# EAGLE design B611B (EAGLE 6.6.0)
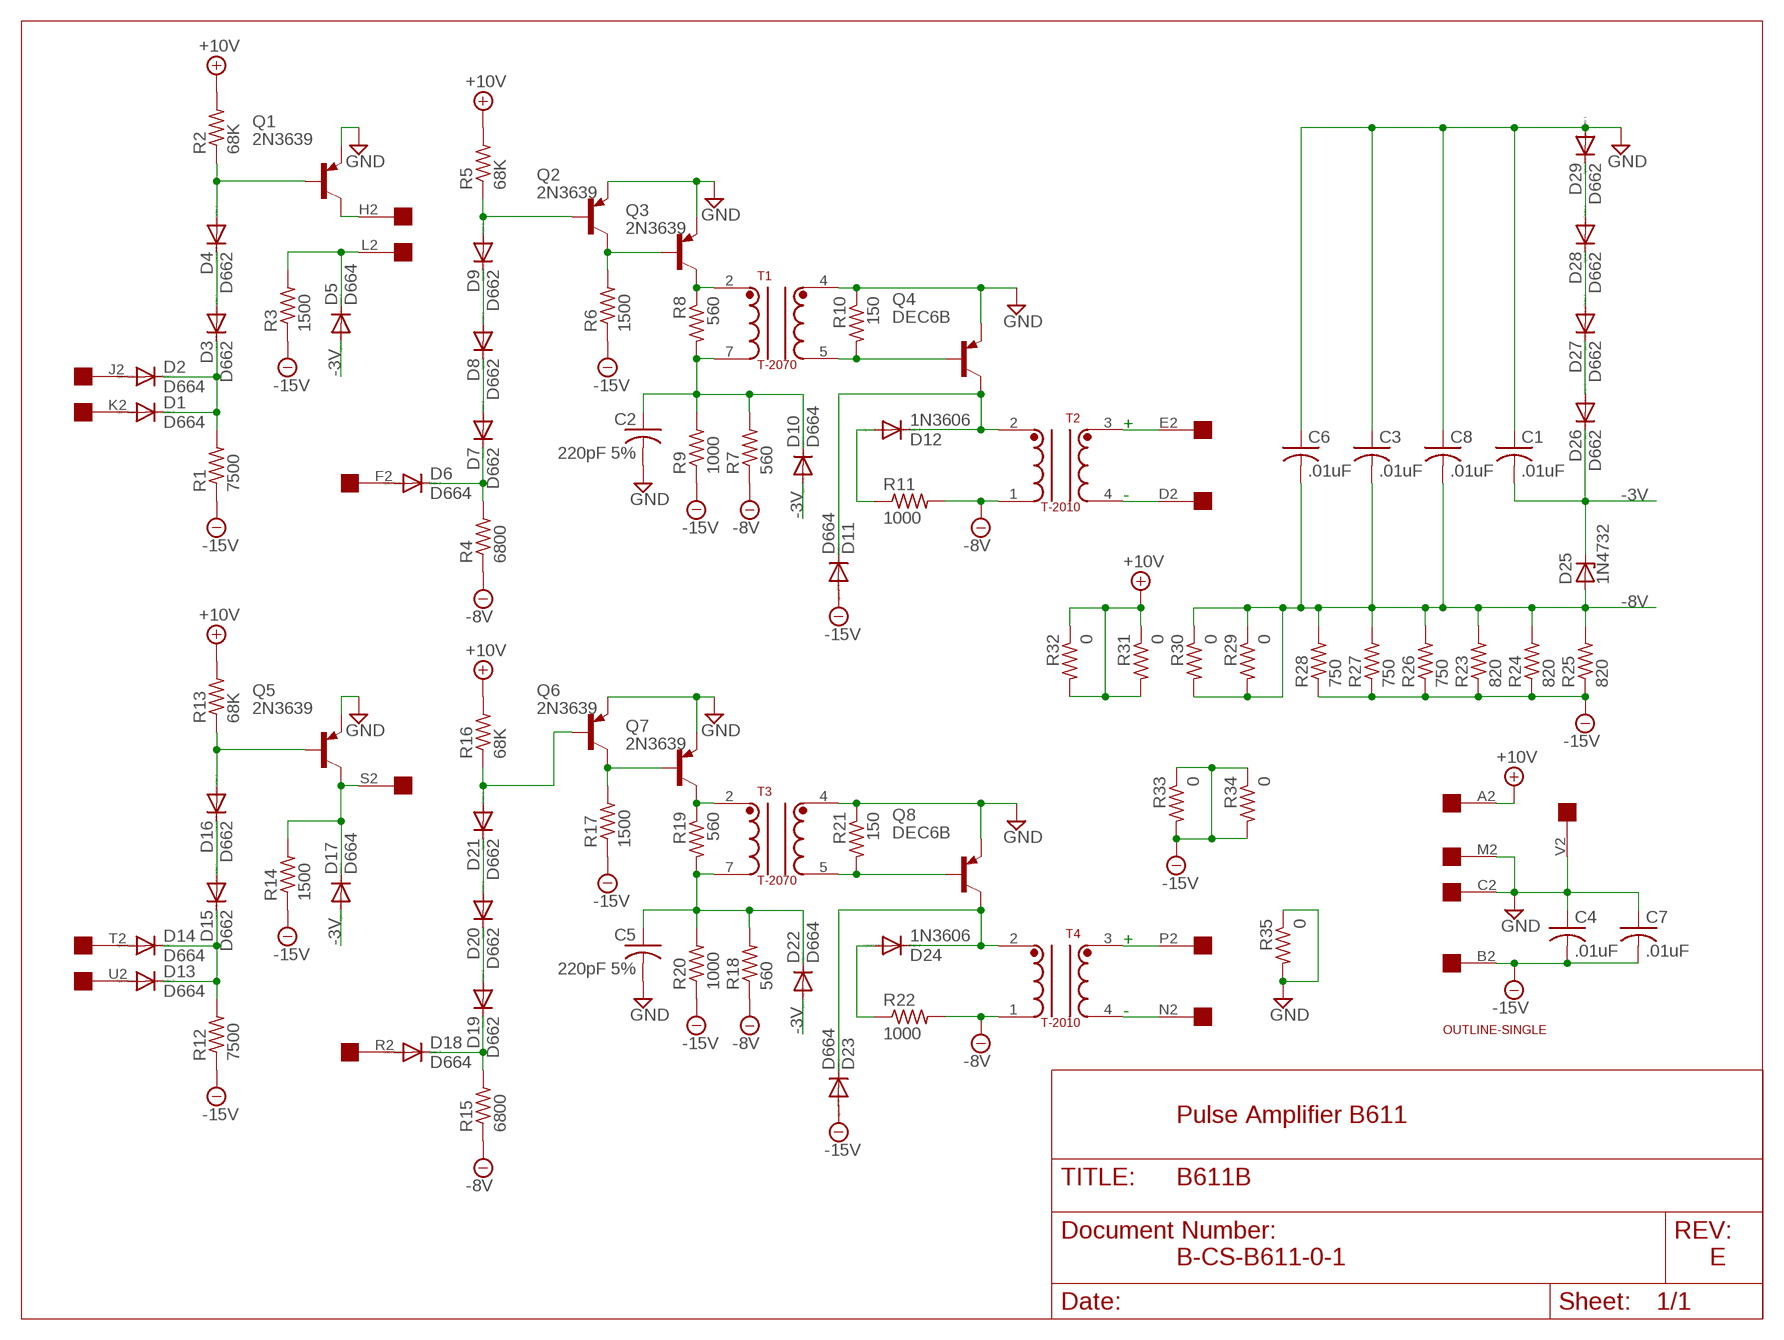
[diagram p0: schematic, sheet 1]

## Parts
C1  .01uF  C-US  [C063-025X075]
C2  220pF 5%  C-US150-054X183  [C150-054X183]
C3  .01uF  C-US  [C063-025X075]
C4  .01uF  C-US  [C063-025X075]
C5  220pF 5%  C-US150-054X183  [C150-054X183]
C6  .01uF  C-US  [C063-025X075]
C7  .01uF  C-US  [C063-025X075]
C8  .01uF  C-US  [C063-025X075]
D1  D664  1N4148DO35-10  [DO35-10]
D2  D664  1N4148DO35-10  [DO35-10]
D3  D662  1N4148DO35-10  [DO35-10]
D4  D662  1N4148DO35-10  [DO35-10]
D5  D664  1N4148DO35-10  [DO35-10]
D6  D664  1N4148DO35-10  [DO35-10]
D7  D662  1N4148DO35-10  [DO35-10]
D8  D662  1N4148DO35-10  [DO35-10]
D9  D662  1N4148DO35-10  [DO35-10]
D10  D664  1N4148DO35-10  [DO35-10]
D11  D664  1N4148DO35-10  [DO35-10]
D12  1N3606  1N4148DO35-10  [DO35-10]
D13  D664  1N4148DO35-10  [DO35-10]
D14  D664  1N4148DO35-10  [DO35-10]
D15  D662  1N4148DO35-10  [DO35-10]
D16  D662  1N4148DO35-10  [DO35-10]
D17  D664  1N4148DO35-10  [DO35-10]
D18  D664  1N4148DO35-10  [DO35-10]
D19  D662  1N4148DO35-10  [DO35-10]
D20  D662  1N4148DO35-10  [DO35-10]
D21  D662  1N4148DO35-10  [DO35-10]
D22  D664  1N4148DO35-10  [DO35-10]
D23  D664  1N4148DO35-10  [DO35-10]
D24  1N3606  1N4148DO35-10  [DO35-10]
D25  1N4732  ZENER-DIODEDO35Z10  [DO35Z10]
D26  D662  1N4148DO35-10  [DO35-10]
D27  D662  1N4148DO35-10  [DO35-10]
D28  D662  1N4148DO35-10  [DO35-10]
D29  D662  1N4148DO35-10  [DO35-10]
Q1  2N3639  2N2904  [TO39]
Q2  2N3639  2N2904  [TO39]
Q3  2N3639  2N2904  [TO39]
Q4  DEC6B  2N2904  [TO39]
Q5  2N3639  2N2904  [TO39]
Q6  2N3639  2N2904  [TO39]
Q7  2N3639  2N2904  [TO39]
Q8  DEC6B  2N2904  [TO39]
R1  7500  R-US_0207/10  [0207/10]
R2  68K  R-US_0207/10  [0207/10]
R3  1500  R-US_0207/10  [0207/10]
R4  6800  R-US_0207/10  [0207/10]
R5  68K  R-US_0207/10  [0207/10]
R6  1500  R-US_0207/10  [0207/10]
R7  560  R-US_0207/10  [0207/10]
R8  560  R-US_0207/10  [0207/10]
R9  1000  R-US_0207/10  [0207/10]
R10  150  R-US_0207/10  [0207/10]
R11  1000  R-US_0207/10  [0207/10]
R12  7500  R-US_0207/10  [0207/10]
R13  68K  R-US_0207/10  [0207/10]
R14  1500  R-US_0207/10  [0207/10]
R15  6800  R-US_0207/10  [0207/10]
R16  68K  R-US_0207/10  [0207/10]
R17  1500  R-US_0207/10  [0207/10]
R18  560  R-US_0207/10  [0207/10]
R19  560  R-US_0207/10  [0207/10]
R20  1000  R-US_0207/10  [0207/10]
R21  150  R-US_0207/10  [0207/10]
R22  1000  R-US_0207/10  [0207/10]
R23  820  R-US_0207/10  [0207/10]
R24  820  R-US_0207/10  [0207/10]
R25  820  R-US_0207/10  [0207/10]
R26  750  R-US_0207/10  [0207/10]
R27  750  R-US_0207/10  [0207/10]
R28  750  R-US_0207/10  [0207/10]
R29  0  R-US_0207/10  [0207/10]
R30  0  R-US_0207/10  [0207/10]
R31  0  R-US_0207/10  [0207/10]
R32  0  R-US_0207/10  [0207/10]
R33  0  R-US_0207/10  [0207/10]
R34  0  R-US_0207/10  [0207/10]
R35  0  R-US_0207/10  [0207/10]
T1  T-2070  T-2037  [TRANSFORMER]
T2  T-2010  [TRANSFORMER2]
T3  T-2070  T-2037  [TRANSFORMER]
T4  T-2010  [TRANSFORMER2]
U$1  OUTLINE-SINGLE  [SINGLE]
U$2  EDGE-1  [EDGE-CON1]

## Nets
+10V [Supply]: R2.2 R5.2 R13.2 R16.2 R31.1 R31.2 R32.1 R32.2 U$2.A2
-3V [Supply]: C1.2 D5.A D10.A D17.A D22.A D25.C D26.C
-8V: C3.2 C6.2 C8.2 D25.A R4.1 R7.1 R11.2 R15.1 R18.1 R22.2 R23.2 R24.2 R25.2 R26.2 R27.2 R28.2 R29.1 R29.2 R30.1 R30.2 T2.1 T4.1
-15V [Supply]: C4.2 C7.2 D11.A D23.A R1.1 R3.1 R6.1 R9.1 R12.1 R14.1 R17.1 R20.1 R23.1 R24.1 R25.1 R26.1 R27.1 R28.1 R33.1 R33.2 R34.1 R34.2 U$2.B2
GND [Supply]: C1.1 C2.2 C3.1 C4.1 C5.2 C6.1 C7.1 C8.1 D29.A Q1.1(E) Q2.1(E) Q3.1(E) Q4.1(E) Q5.1(E) Q6.1(E) Q7.1(E) Q8.1(E) R10.1 R21.1 R35.1 R35.2 T1.4 T3.4 U$2.C2 U$2.M2 U$2.V2
N$1: D16.A Q5.2(B) R13.1
N$2: D12.A R11.1
N$3: T2.3 U$2.E2
N$4: T2.4 U$2.D2
N$5: Q2.3(C) Q3.2(B) R6.2
N$6: D11.C D12.C Q4.3(C) T2.2
N$7: D9.A Q2.2(B) R5.1
N$8: C2.1 D10.C R7.2 R8.2 R9.2 T1.7
N$9: Q4.2(B) R10.2 T1.5
N$10: D8.A D9.C
N$11: D7.A D8.C
N$12: D6.C D7.C R4.2
N$13: D6.A U$2.F2
N$14 [Supply]: Q3.3(C) R8.1 T1.2
N$15: D5.C R3.2 U$2.L2
N$16: Q1.3(C) U$2.H2
N$17: D2.A U$2.J2
N$18: D1.C D2.C D3.C R1.2
N$19: D4.A Q1.2(B) R2.1
N$20: D3.A D4.C
N$21: D1.A U$2.K2
N$22: D17.C Q5.3(C) R14.2 U$2.S2
N$23: D21.A Q6.2(B) R16.1
N$24: D13.C D14.C D15.C R12.2
N$25: D15.A D16.C
N$26: D28.A D29.C
N$27: D27.A D28.C
N$28: D14.A U$2.T2
N$29: D26.A D27.C
N$30: D13.A U$2.U2
N$31: D20.A D21.C
N$32: D19.A D20.C
N$33: D18.C D19.C R15.2
N$34: D18.A U$2.R2
N$35: T4.3 U$2.P2
N$36: T4.4 U$2.N2
N$37: D23.C D24.C Q8.3(C) T4.2
N$38: C5.1 D22.C R18.2 R19.2 R20.2 T3.7
N$39: Q8.2(B) R21.2 T3.5
N$40 [Supply]: Q7.3(C) R19.1 T3.2
N$41: D24.A R22.1
N$42: Q6.3(C) Q7.2(B) R17.2

## Notes on the sheet
- +
- -
- +
- -
- Pulse Amplifier B611
- B-CS-B611-0-1 | E

## Library data of the parts
C1 C3 C4 C6-C8 = dec-con:C-US: Capacitors with funky DEC lead spacing.
C2 C5 = rcl:C-US: CAPACITOR, American symbol
D1-D24 D26-D29 = diode:1N4148: DIODE high speed (Philips)
D25 = diode:ZENER-DIODE: Z-Diode
Q1-Q8 = transistor-pnp:2N2904*: PNP Transistror
R1-R35 = rcl:R-US_: RESISTOR, American symbol
T1 T3 = dec-con:T-2037: T-2037 Transformer
T2 T4 = dec-con:T-2010: Button Transformer
U$1 = dec-con:OUTLINE-*: Board outlines for DEC boards.
U$2 = dec-con:EDGE-1: Single-Sided DEC Edge Connector -- (side 2)

## Net classes
0 default: width 0.813 mm
1 Supply: width 0.813 mm

## Board
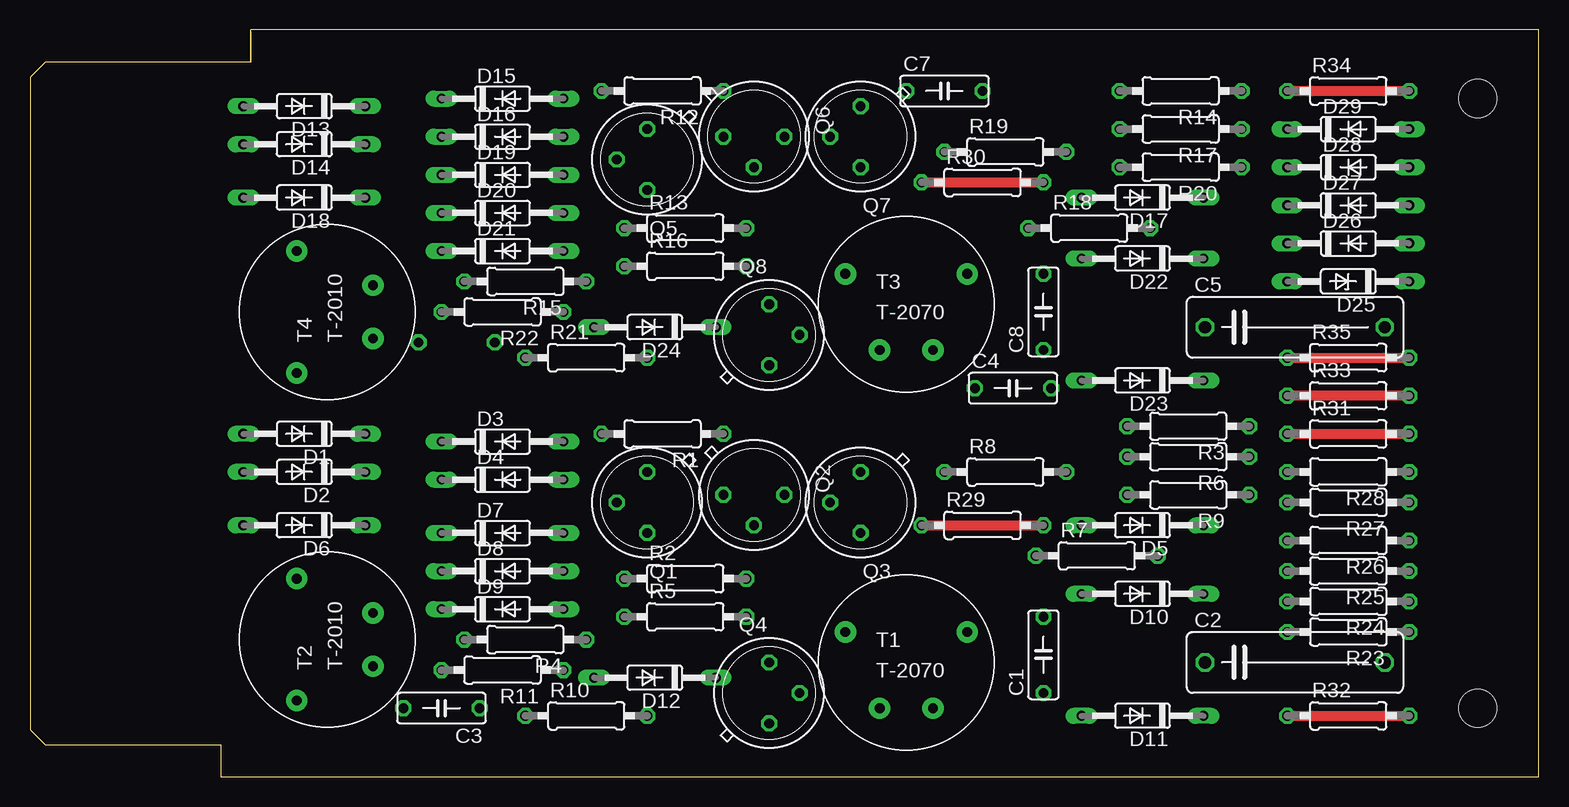
[diagram p1: board, top side]
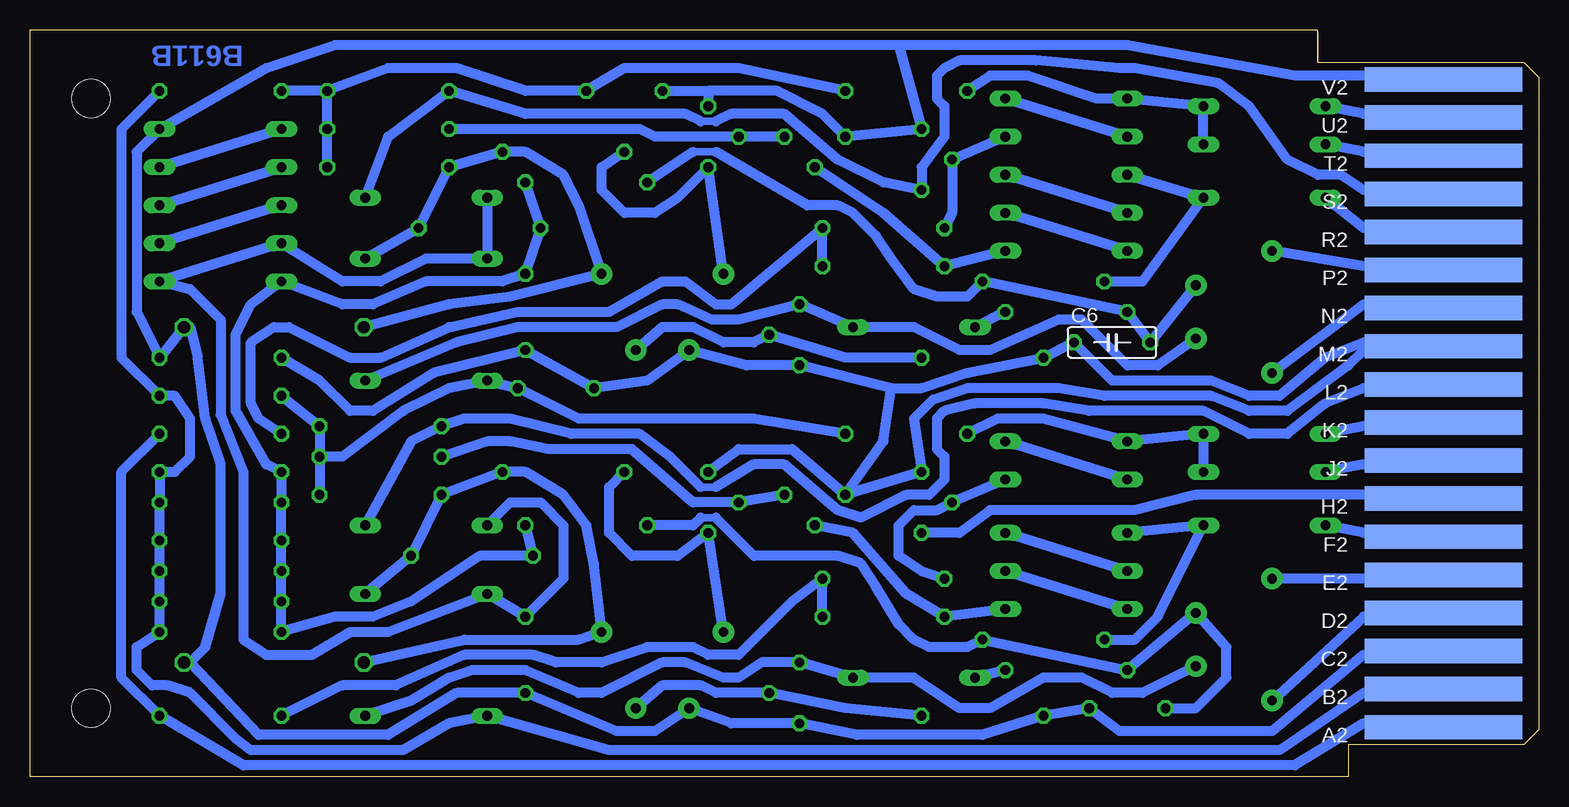
[diagram p2: board, bottom side, seen from below]

Size 125.73 x 62.23 mm. Coordinates in mm from the lower left corner, seen from the top.
Copper layers (1+16): Top 0.035mm / dielectric 1.5mm / Bottom 0.035mm
Design rules "16mils": minimum track width 16mil, minimum drill 32mil, track to track 15mil, track to pad 10mil, pad to pad 10mil, via to via 10mil, smd to smd 10mil, copper to edge 13mil, drill to drill 10mil, minimum pad ring 10mil, minimum via ring 8mil, stop-mask expansion 0mil, vias tented up to drill 0mil, thermal gap 10mil

### Footprints (pad centres in the part's own frame; a part is rotated, then mirrored left to right if it is on the bottom)
C063-025X075 = drill 0.813 octagon: 1 -2.54,0; 2 3.81,0
C150-054X183 = drill 1.016 octagon: 1 -7.493,0; 2 7.493,0
DO35-10 = drill 0.813 long: A 5.08,0; C -5.08,0
DO35Z10 = drill 0.813 long: A 5.08,0; C -5.08,0
TO39 = drill 0.813 octagon: 1 0,-2.54; 2 2.54,0; 3 0,2.54
0207/10 = drill 0.813 octagon: 1 -5.08,0; 2 5.08,0
TRANSFORMER = drill 0.813 pad 1.778: 2 -5.08,2.54; 4 -2.223,-3.81; 5 2.223,-3.81; 7 5.08,2.54
TRANSFORMER2 = drill 0.813 pad 1.778: 1 2.223,-3.81; 2 -2.223,-3.81; 3 5.08,2.54; 4 -5.08,2.54
SINGLE = hole 3.175: 120.65,56.515; 120.65,5.715
EDGE-CON1 = smd 13.106 x 2.032 bottom: A2 7.938,4.128; B2 7.938,7.303; C2 7.938,10.477; D2 7.938,13.652; E2 7.938,16.828; F2 7.938,20.003; H2 7.938,23.177; J2 7.938,26.352; K2 7.938,29.527; L2 7.938,32.703; M2 7.938,35.877; N2 7.938,39.053; P2 7.938,42.227; R2 7.938,45.403; S2 7.938,48.578; T2 7.938,51.752; U2 7.938,54.928; V2 7.938,58.102

### Placement (x,y rotation side)
C1  84.46,9.53 90 top
C2  105.41,9.53 0 top
C3  34.93,5.71 180 top
C4  81.28,32.38 0 top
C5  105.41,37.47 0 top
C6  36.2,36.2 0 bottom
C7  75.57,57.15 0 top
C8  84.46,38.1 90 top
D1  22.86,28.57 180 top
D2  22.86,25.4 180 top
D3  39.37,27.94 0 top
D4  39.37,24.77 0 top
D5  92.71,20.95 180 top
D6  22.86,20.95 180 top
D7  39.37,20.32 0 top
D8  39.37,17.14 0 top
D9  39.37,13.97 0 top
D10  92.71,15.24 180 top
D11  92.71,5.08 180 top
D12  52.07,8.26 180 top
D13  22.86,55.88 180 top
D14  22.86,52.7 180 top
D15  39.37,56.52 0 top
D16  39.37,53.34 0 top
D17  92.71,48.26 180 top
D18  22.86,48.26 180 top
D19  39.37,50.16 0 top
D20  39.37,46.99 0 top
D21  39.37,43.81 0 top
D22  92.71,43.18 180 top
D23  92.71,33.02 180 top
D24  52.07,37.47 180 top
D25  109.86,41.27 180 top
D26  109.86,44.45 0 top
D27  109.86,47.62 0 top
D28  109.86,50.8 0 top
D29  109.86,53.98 0 top
Q1  51.44,22.86 180 top
Q2  60.33,23.5 270 top
Q3  69.22,22.86 180 top
Q4  61.6,6.99 0 top
Q5  51.44,51.44 180 top
Q6  60.33,53.34 270 top
Q7  69.22,53.34 180 top
Q8  61.6,36.83 0 top
R1  52.71,28.57 180 top
R2  54.61,16.51 0 top
R3  96.52,29.21 180 top
R4  41.28,11.43 180 top
R5  54.61,13.34 0 top
R6  96.52,26.67 180 top
R7  88.9,18.41 0 top
R8  81.28,25.4 0 top
R9  96.52,23.5 180 top
R10  46.36,5.08 0 top
R11  39.37,8.89 180 top
R12  52.71,57.15 180 top
R13  54.61,45.72 0 top
R14  95.89,57.15 180 top
R15  41.28,41.27 180 top
R16  54.61,42.55 0 top
R17  95.89,53.98 180 top
R18  88.27,45.72 0 top
R19  81.28,52.07 0 top
R20  95.89,50.8 180 top
R21  46.36,34.92 0 top
R22  39.37,38.73 180 top
R23  109.86,12.06 180 top
R24  109.86,14.61 180 top
R25  109.86,17.14 180 top
R26  109.86,19.68 180 top
R27  109.86,22.86 180 top
R28  109.86,25.4 180 top
R29  79.38,20.95 0 top
R30  79.38,49.53 0 top
R31  109.86,28.57 0 top
R32  109.86,5.08 0 top
R33  109.86,31.75 0 top
R34  109.86,57.15 0 top
R35  109.86,34.92 0 top
T1  73.03,9.53 0 top
T2  24.77,11.43 90 top
T3  73.03,39.37 0 top
T4  24.77,38.73 90 top
U$1  0,0 0 top
U$2  0,0 0 top

### Tracks (layer width: path | path; a pad name or v marks a point on that pad's centre or on a via)
+10V
  Top 0.813: R31.1 R31.2 | R32.1 R32.2
  Bottom 0.813: R31.1 106.68,29.84 107.32,31.11 107.32,36.2 105.41,37.47 104.14,37.47 99.06,34.92 96.52,34.92 90.81,37.47 85.09,38.73 77.47,38.73 73.03,41.27 71.12,41.27 68.58,39.37 67.31,39.37 R13.2 R16.2 | R5.2 R2.2 62.23,14.61 66.68,10.16 69.22,10.16 70.49,10.79 74.3,10.79 78.11,9.53 81.92,9.53 83.82,10.16 89.54,10.16 95.25,7.62 99.7,7.62 R32.1 | U$2.A2 8.26,4.45 14.61,4.45 20.32,0.95 107.95,0.95 R32.2 118.11,8.26 118.11,25.4 R31.2
-3V
  Bottom 0.813: D17.A D22.A 92.71,43.18 96.52,41.27 99.7,41.27 D26.C D25.C 112.4,40.64 109.86,38.1 109.86,30.16 107.95,25.4 107.95,11.43 106.05,10.16 102.24,10.16 99.06,12.06 95.89,12.06 D10.A C1.2 81.28,16.51 81.28,20.95 83.19,22.86 85.73,22.86 D5.A
-8V
  Top 0.813: R29.1 R29.2 | R30.1 R30.2
  Bottom 0.61: 68.58,21.59 69.85,21.59 | 68.58,52.07 70.49,52.07
  Bottom 0.813: 68.58,21.59 65.41,18.41 58.42,18.41 56.52,17.78 55.25,15.88 53.34,12.7 52.07,11.43 50.8,10.79 47.63,10.79 R4.1 R11.2 T2.1 26.04,10.79 26.04,8.26 28.58,5.71 C3.2 | 69.85,21.59 70.49,20.95 R29.1 | R29.2 R7.1 88.27,18.41 93.98,14.61 97.16,13.34 100.33,13.34 R23.2 R24.2 R25.2 R26.2 R27.2 R28.2 106.05,26.04 108.59,30.48 108.59,36.83 107.32,39.37 D25.A 99.7,39.37 97.16,39.37 92.71,41.27 86.36,41.27 C8.2 R18.1 R30.2 | 68.58,52.07 60.96,47.62 58.42,47.62 57.15,46.99 55.25,45.09 53.98,43.18 52.07,40.64 50.17,40.01 47.63,40.01 R15.1 R22.2 C6.2 T4.1 | 70.49,52.07 R30.1
-15V
  Top 0.813: R33.2 R33.1 | R34.1 R34.2
  Bottom 0.813: R33.1 R3.1 R6.1 | R6.1 R9.1 | R12.1 66.68,59.05 76.2,59.05 C7.2 84.46,57.15 90.17,59.05 95.89,59.05 R14.1 | R14.1 R34.1 | R14.1 R17.1 R20.1 | R1.1 65.41,29.84 80.01,29.84 C4.2 D23.A 90.81,32.38 94.62,30.48 99.7,26.67 R6.1 | U$2.B2 8.89,6.99 14.61,6.99 21.59,2.22 77.47,2.22 D11.A 90.81,4.45 94.62,2.22 107.32,2.22 108.59,3.17 112.4,6.99 114.3,7.62 115.57,7.62 116.84,8.89 116.84,10.79 R23.1 R24.1 R25.1 R26.1 R27.1 R28.1 113.67,25.4 112.4,26.67 112.4,29.84 113.67,31.75 R33.2 118.11,34.92 118.11,53.98 R34.2
GND
  Top 0.813: R35.1 R35.2
  Bottom 0.813: R35.1 101.6,33.02 99.06,30.48 97.16,30.48 92.08,33.66 C8.1 C4.1 74.3,33.02 T3.4 66.04,34.29 Q8.1 53.98,32.38 | Q2.1 Q1.1 52.07,29.84 50.48,31.43 47.63,32.38 40.01,32.38 36.2,31.75 27.31,31.75 24.13,30.48 20.96,30.48 15.88,34.29 14.61,35.56 14.61,36.2 | U$2.V2 8.89,58.42 20.32,58.42 34.29,60.96 53.34,60.96 | 53.34,60.96 Q5.1 Q6.1 59.69,55.24 63.5,57.15 69.22,57.15 | C7.1 69.22,57.15 | 69.22,57.15 Q7.1 | 53.34,60.96 100.33,60.96 106.05,59.05 D29.A 116.84,52.07 116.84,38.73 R35.2 C5.2 112.4,37.47 111.76,34.92 111.13,29.84 109.86,26.04 109.86,15.24 111.13,10.79 112.4,9.53 | U$2.M2 8.26,36.2 14.61,36.2 | 14.61,36.2 17.78,34.92 21.59,31.75 24.13,31.75 27.31,33.02 35.56,33.02 C6.1 R21.1 47.63,33.66 51.44,32.38 53.98,32.38 | Q2.1 54.61,27.94 53.98,32.38 | Q3.1 66.68,27.3 62.23,27.3 Q2.1 | U$2.C2 8.89,10.16 14.61,10.16 22.23,3.81 34.93,3.81 C3.1 R10.1 46.36,3.49 56.83,3.49 Q4.1 67.31,4.45 T1.4 73.66,3.81 76.84,3.81 C1.1 90.17,6.99 95.89,3.49 106.68,3.49 112.4,9.53 | C2.2 112.4,9.53
N$1
  Bottom 0.813: D16.A Q5.2 48.9,46.99 R13.1
N$2
  Bottom 0.813: R11.1 D12.A
N$3
  Bottom 0.813: U$2.E2 8.89,16.51 T2.3
N$4
  Bottom 0.813: U$2.D2 9.53,13.34 14.61,13.34 T2.4
N$5
  Bottom 0.813: Q2.3 Q3.2 70.49,22.86 75.57,27.3 82.55,27.3 85.73,27.94 87.63,27.94 R6.2
N$6
  Bottom 0.813: T2.2 33.02,6.99 35.56,6.99 38.1,8.26 41.28,8.26 45.72,5.71 48.26,5.71 52.07,8.26 D12.C Q4.3 64.77,9.53 66.68,8.26 67.95,8.26 71.12,9.53 73.03,9.53 78.11,6.99 80.01,6.99 84.46,8.89 88.9,8.89 90.81,8.26 93.98,6.35 D11.C
N$7
  Bottom 0.813: D9.A R5.1 52.71,15.24 57.15,20.32 Q2.2
N$8
  Bottom 0.813: D10.C R7.2 R9.2 R8.2 84.46,25.4 81.28,23.5 79.38,20.95 78.74,17.78 T1.7 80.01,11.43 89.54,11.43 C2.1
N$9
  Bottom 0.813: R10.2 57.79,5.71 Q4.2 68.58,6.99 69.85,7.62 73.03,7.62 T1.5
N$10
  Bottom 0.813: D9.C D8.A
N$11
  Bottom 0.813: D8.C D7.A
N$12
  Bottom 0.813: D7.C D6.C 31.75,13.34 33.66,11.43 R4.2
N$13
  Bottom 0.813: U$2.F2 8.89,20.32 14.61,20.32 D6.A
N$14
  Bottom 0.813: T1.2 Q3.3 71.76,18.41 75.57,18.41 77.47,20.32 77.47,24.13 R8.1
N$15
  Bottom 0.61: 68.58,24.13 69.85,24.13
  Bottom 0.813: D5.C 93.98,27.94 R3.2 89.54,29.84 85.73,29.84 80.65,28.57 74.93,28.57 72.39,26.67 69.85,24.13 | U$2.L2 9.53,32.38 14.61,32.38 17.78,31.11 20.96,28.57 24.13,28.57 27.94,30.48 37.47,30.48 41.28,31.11 46.99,31.11 49.53,30.48 50.17,29.84 50.17,27.3 49.53,26.67 49.53,24.77 50.8,23.5 52.71,23.5 56.52,21.59 58.42,22.23 62.87,26.04 65.41,26.04 68.58,24.13
N$16
  Bottom 0.813: U$2.H2 10.16,23.5 28.58,23.5 33.66,22.23 45.72,22.23 48.26,20.32 Q1.3
N$17
  Bottom 0.813: U$2.J2 8.89,26.04 14.61,26.04 D2.A
N$18
  Bottom 0.813: D2.C D1.C D3.C 41.28,29.84 45.09,29.84 R1.2
N$19
  Bottom 0.813: D4.A Q1.2 50.17,22.23 52.07,22.23 53.34,20.95 53.34,18.41 51.44,17.14 R2.1
N$20
  Bottom 0.813: D4.C D3.A
N$21
  Bottom 0.813: U$2.K2 8.89,29.21 14.61,29.21 D1.A
N$22
  Bottom 0.61: 68.58,54.61 69.85,54.61
  Bottom 0.813: D17.C 95.89,53.34 R14.2 84.46,55.24 71.12,55.24 69.85,54.61 | U$2.S2 8.26,48.9 14.61,48.9 16.51,50.16 18.42,50.16 20.96,51.44 24.13,55.88 26.67,57.78 33.66,59.05 34.93,59.05 41.91,59.69 48.26,59.69 49.53,59.05 50.17,58.42 50.17,56.52 49.53,55.88 49.53,53.34 51.44,50.8 Q5.3 54.61,49.53 58.42,51.44 62.87,55.24 67.31,55.24 68.58,54.61
N$23
  Bottom 0.813: D21.A R16.1 54.61,46.99 Q6.2
N$24
  Bottom 0.813: D14.C D13.C D15.C 36.83,56.52 42.55,58.42 45.72,58.42 R12.2
N$25
  Bottom 0.813: D16.C D15.A
N$26
  Bottom 0.813: D29.C D28.A
N$27
  Bottom 0.813: D27.A D28.C
N$28
  Bottom 0.813: U$2.T2 8.89,52.07 14.61,52.07 D14.A
N$29
  Bottom 0.813: D27.C D26.A
N$30
  Bottom 0.813: U$2.U2 8.89,55.24 14.61,55.24 D13.A
N$31
  Bottom 0.813: D21.C D20.A
N$32
  Bottom 0.813: D20.C D19.A
N$33
  Bottom 0.813: D19.C D18.C 33.02,41.27 R15.2
N$34
  Bottom 0.813: U$2.R2 8.89,45.72 14.61,45.72 D18.A
N$35
  Bottom 0.813: U$2.P2 8.89,42.55 14.61,42.55 T4.3
N$36
  Bottom 0.813: U$2.N2 8.89,39.37 14.61,39.37 T4.4
N$37
  Bottom 0.813: D23.C 90.17,36.2 85.09,37.47 76.84,37.47 73.03,39.37 71.76,39.37 68.9,38.1 66.68,38.1 Q8.3 D24.C 52.07,37.47 48.26,35.56 45.72,35.56 40.01,38.1 38.1,38.1 34.29,34.29 31.75,34.29 T4.2
N$38
  Bottom 0.813: C5.1 90.81,39.37 85.73,40.01 T3.7 80.01,47.62 81.28,50.16 84.46,52.07 R19.2 R20.2 R18.2 D22.C
N$39
  Bottom 0.813: T3.5 73.03,37.47 70.49,37.47 67.95,36.2 65.41,36.2 Q8.2 57.79,34.92 R21.2
N$40
  Bottom 0.813: T3.2 Q7.3 71.76,48.26 73.66,46.99 76.2,46.99 78.11,48.9 78.11,50.8 R19.1
N$41
  Bottom 0.813: R22.1 D24.A
N$42
  Bottom 0.813: Q6.3 Q7.2 73.66,53.34 74.93,53.98 R17.2

### Text on the board
Bottom: B611B